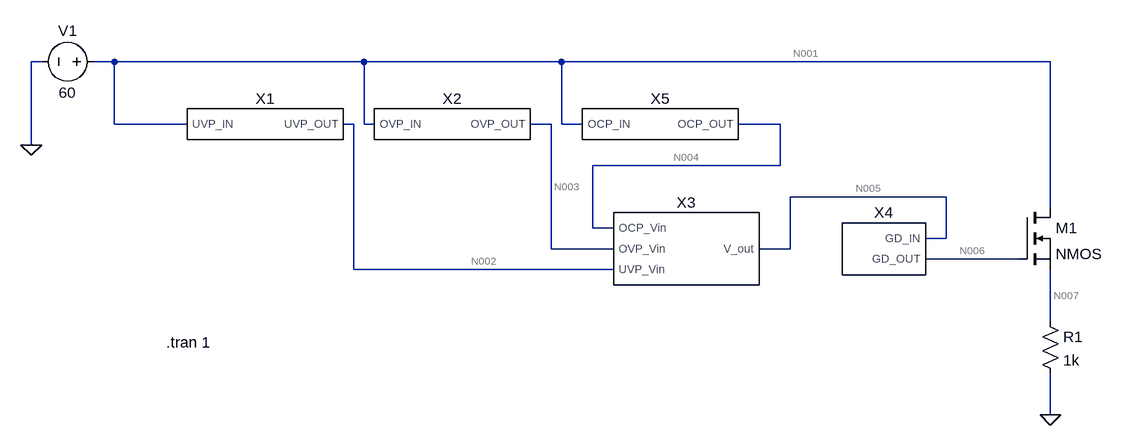
[diagram p0: schematic All.asc]
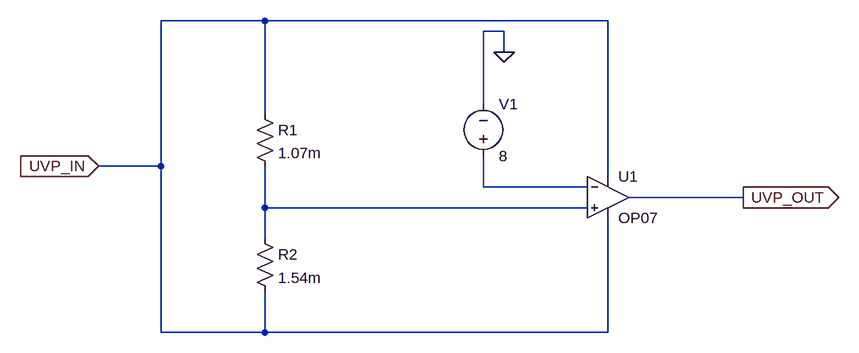
[diagram p1: sub-circuit uvp.asc]
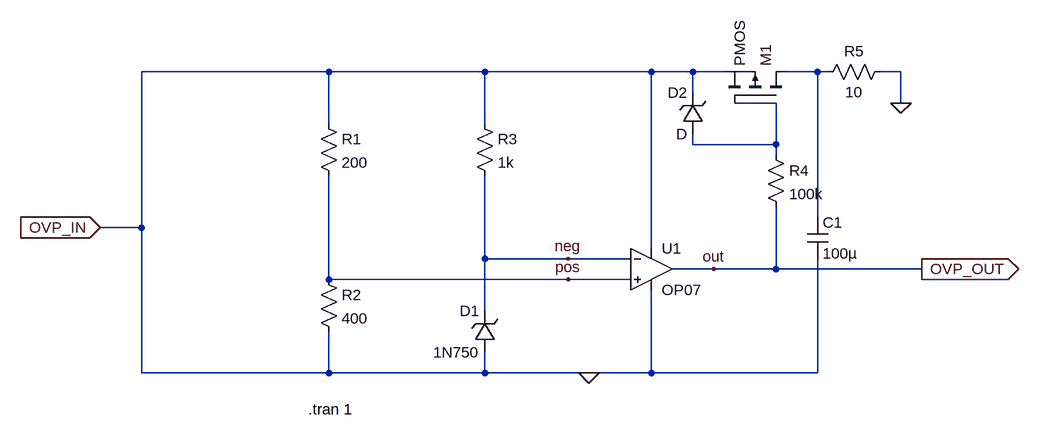
[diagram p2: sub-circuit ovp.asc]
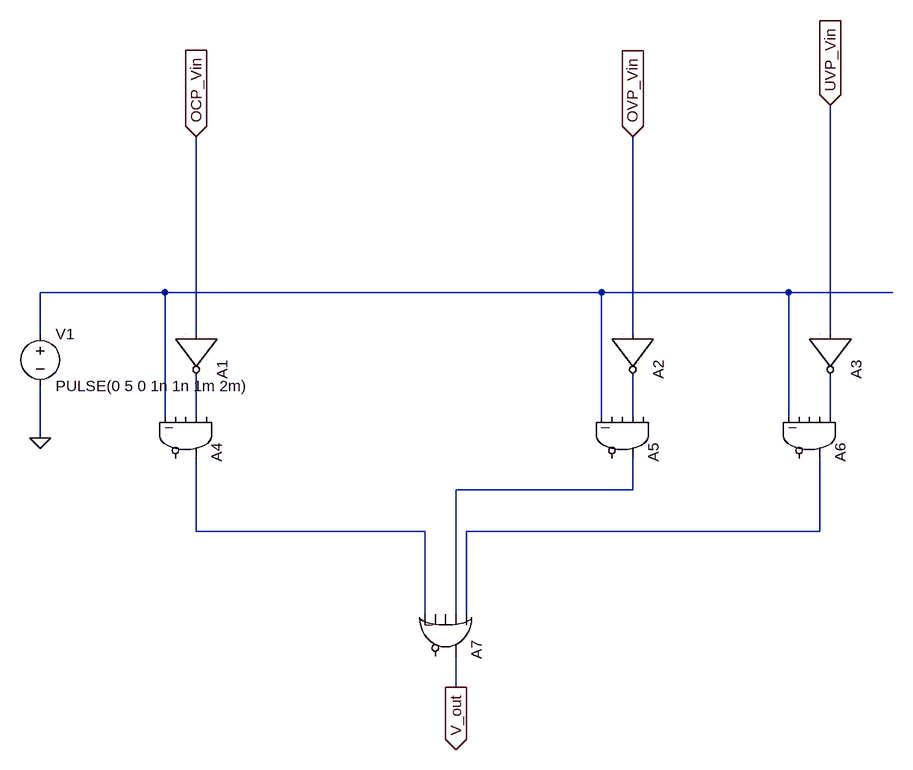
[diagram p3: sub-circuit control.asc]
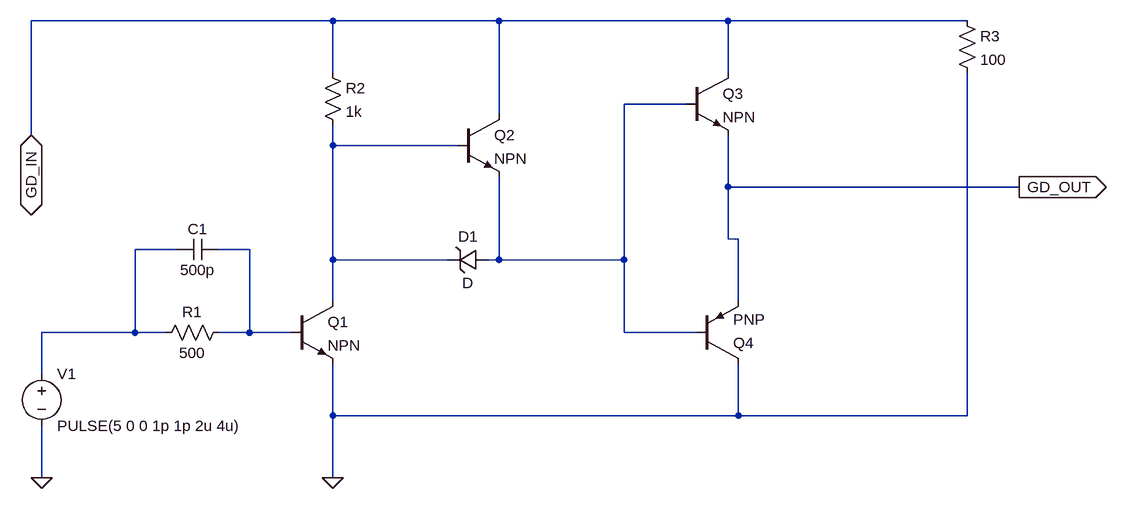
[diagram p4: sub-circuit gatedriver.asc]
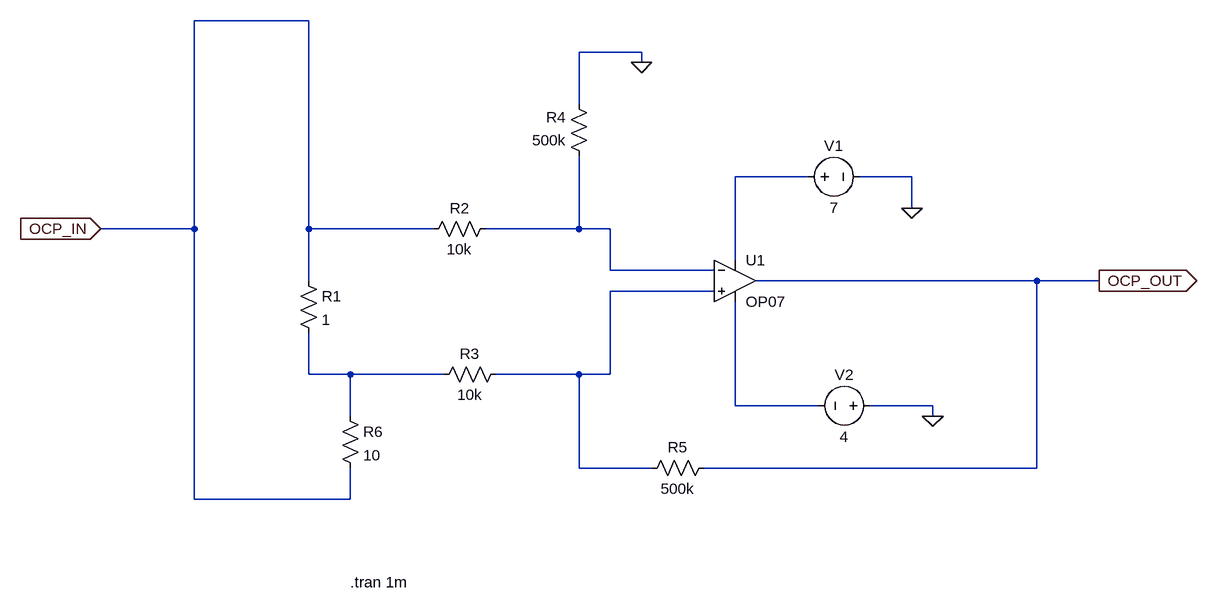
[diagram p5: sub-circuit ocp.asc]
All.asc, the LTspice schematic file:
Version 4
SHEET 1 1532 680
WIRE -96 80 -112 80
WIRE 16 80 -16 80
WIRE 400 80 16 80
WIRE 704 80 400 80
WIRE 1456 80 704 80
WIRE 16 176 16 80
WIRE 128 176 16 176
WIRE 384 176 368 176
WIRE 400 176 400 80
WIRE 416 176 400 176
WIRE 688 176 656 176
WIRE 704 176 704 80
WIRE 736 176 704 176
WIRE 1040 176 976 176
WIRE -112 208 -112 80
WIRE 1040 240 1040 176
WIRE 1040 240 752 240
WIRE 1296 288 1056 288
WIRE 1456 304 1456 80
WIRE 752 336 752 240
WIRE 784 336 752 336
WIRE 1296 352 1296 288
WIRE 1296 352 1264 352
WIRE 688 368 688 176
WIRE 784 368 688 368
WIRE 1056 368 1056 288
WIRE 1056 368 1008 368
WIRE 1408 384 1264 384
WIRE 384 400 384 176
WIRE 784 400 384 400
WIRE 1456 480 1456 400
WIRE 1456 624 1456 560
FLAG -112 208 0
FLAG 1456 624 0
SYMBOL voltage 0 80 R90
WINDOW 0 -32 56 VBottom 2
WINDOW 3 32 56 VTop 2
SYMATTR InstName V1
SYMATTR Value 60
SYMBOL UVP 240 176 R0
SYMATTR InstName X1
SYMBOL OVP 528 176 R0
SYMATTR InstName X2
SYMBOL Control 896 368 R0
SYMATTR InstName X3
SYMBOL GateDriver 1200 368 R0
SYMATTR InstName X4
SYMBOL nmos 1408 304 R0
SYMATTR InstName M1
SYMBOL res 1440 464 R0
SYMATTR InstName R1
SYMATTR Value 1k
SYMBOL OCP 848 176 R0
SYMATTR InstName X5
TEXT 96 512 Left 2 !.tran 1

uvp.asc, the sub-circuit schematic file:
Version 4
SHEET 1 1160 680
WIRE 272 64 112 64
WIRE 800 64 272 64
WIRE 640 80 608 80
WIRE 640 112 640 80
WIRE 608 192 608 80
WIRE 272 208 272 64
WIRE 112 288 112 64
WIRE 112 288 16 288
WIRE 800 304 800 64
WIRE 608 320 608 272
WIRE 768 320 608 320
WIRE 1008 336 832 336
WIRE 272 352 272 288
WIRE 768 352 272 352
WIRE 272 400 272 352
WIRE 112 544 112 288
WIRE 272 544 272 480
WIRE 272 544 112 544
WIRE 800 544 800 368
WIRE 800 544 272 544
FLAG 640 112 0
FLAG 16 288 UVP_IN
IOPIN 16 288 In
FLAG 1008 336 UVP_OUT
IOPIN 1008 336 Out
SYMBOL Res 256 192 R0
SYMATTR InstName R1
SYMATTR Value 1.07m
SYMBOL Res 256 384 R0
SYMATTR InstName R2
SYMATTR Value 1.54m
SYMBOL voltage 608 288 M180
WINDOW 0 24 96 Left 2
WINDOW 3 24 16 Left 2
SYMATTR InstName V1
SYMATTR Value 8
SYMBOL OpAmps/OP07 800 272 R0
SYMATTR InstName U1

ovp.asc, the sub-circuit schematic file:
Version 4
SHEET 1 1208 680
WIRE 144 96 -144 96
WIRE 384 96 144 96
WIRE 640 96 384 96
WIRE 704 96 640 96
WIRE 752 96 704 96
WIRE 896 96 848 96
WIRE 912 96 896 96
WIRE 1024 96 992 96
WIRE 704 128 704 96
WIRE 832 144 768 144
WIRE 1024 144 1024 96
WIRE 144 176 144 96
WIRE 384 176 384 96
WIRE 704 208 704 192
WIRE 832 208 832 144
WIRE 832 208 704 208
WIRE 832 224 832 208
WIRE 896 320 896 96
WIRE -144 336 -144 96
WIRE -144 336 -208 336
WIRE 640 368 640 96
WIRE 384 384 384 256
WIRE 512 384 384 384
WIRE 608 384 512 384
WIRE 736 400 672 400
WIRE 832 400 832 304
WIRE 832 400 736 400
WIRE 1056 400 832 400
WIRE 144 416 144 256
WIRE 512 416 144 416
WIRE 608 416 512 416
WIRE 384 464 384 384
WIRE -144 560 -144 336
WIRE 144 560 144 496
WIRE 144 560 -144 560
WIRE 384 560 384 528
WIRE 384 560 144 560
WIRE 544 560 384 560
WIRE 640 560 640 432
WIRE 640 560 544 560
WIRE 896 560 896 384
WIRE 896 560 640 560
FLAG 1024 144 0
FLAG 544 560 0
FLAG 512 384 neg
FLAG 512 416 pos
FLAG 736 400 out
FLAG -208 336 OVP_IN
IOPIN -208 336 In
FLAG 1056 400 OVP_OUT
IOPIN 1056 400 Out
SYMBOL Res 128 160 R0
SYMATTR InstName R1
SYMATTR Value 200
SYMBOL Res 128 400 R0
SYMATTR InstName R2
SYMATTR Value 400
SYMBOL Res 368 160 R0
SYMATTR InstName R3
SYMATTR Value 1k
SYMBOL OpAmps/OP07 640 336 R0
SYMATTR InstName U1
SYMBOL zener 400 528 R180
WINDOW 0 24 64 Left 2
WINDOW 3 24 0 Left 2
SYMATTR InstName D1
SYMATTR Value 1N750
SYMBOL Res 816 208 R0
SYMATTR InstName R4
SYMATTR Value 100k
SYMBOL pmos 848 144 M270
SYMATTR InstName M1
SYMBOL zener 720 192 R180
WINDOW 0 24 64 Left 2
WINDOW 3 24 0 Left 2
SYMATTR InstName D2
SYMBOL Res 1008 80 R90
WINDOW 0 0 56 VBottom 2
WINDOW 3 32 56 VTop 2
SYMATTR InstName R5
SYMATTR Value 10
SYMBOL cap 880 320 R0
SYMATTR InstName C1
SYMATTR Value 100µ
TEXT 112 616 Left 2 !.tran 1

control.asc, the sub-circuit schematic file:
Version 4
SHEET 1 1172 1120
WIRE 16 160 -176 160
WIRE 688 160 16 160
WIRE 976 160 688 160
WIRE 1136 160 976 160
WIRE -176 224 -176 160
WIRE 64 224 64 -80
WIRE 736 224 736 -80
WIRE 1040 224 1040 -128
WIRE 16 352 16 160
WIRE 64 352 64 288
WIRE 688 352 688 160
WIRE 736 352 736 288
WIRE 976 352 976 160
WIRE 1040 352 1040 288
WIRE -176 384 -176 304
WIRE 736 464 736 416
WIRE 736 464 464 464
WIRE 64 528 64 416
WIRE 416 528 64 528
WIRE 1024 528 1024 416
WIRE 1024 528 480 528
WIRE 416 656 416 528
WIRE 464 656 464 464
WIRE 480 656 480 528
WIRE 464 768 464 720
FLAG -176 384 0
FLAG 64 -80 OCP_Vin
IOPIN 64 -80 In
FLAG 736 -80 OVP_Vin
IOPIN 736 -80 In
FLAG 1040 -128 UVP_Vin
IOPIN 1040 -128 In
FLAG 464 768 V_out
IOPIN 464 768 Out
SYMBOL Digital/inv 128 224 R90
SYMATTR InstName A1
SYMBOL Digital/inv 800 224 R90
SYMATTR InstName A2
SYMBOL Digital/inv 1104 224 R90
SYMATTR InstName A3
SYMBOL voltage -176 208 R0
SYMATTR InstName V1
SYMATTR Value PULSE(0 5 0 1n 1n 1m 2m)
SYMBOL Digital/and 112 384 R90
SYMATTR InstName A4
SYMBOL Digital/and 784 384 R90
SYMATTR InstName A5
SYMBOL Digital/and 1072 384 R90
SYMATTR InstName A6
SYMBOL Digital/or 512 688 R90
SYMATTR InstName A7

gatedriver.asc, the sub-circuit schematic file:
Version 4
SHEET 1 1304 720
WIRE 112 0 -352 0
WIRE 368 0 112 0
WIRE 720 0 368 0
WIRE 1088 0 720 0
WIRE 112 80 112 0
WIRE 720 80 720 0
WIRE 656 128 560 128
WIRE 368 144 368 0
WIRE -352 176 -352 0
WIRE 112 192 112 160
WIRE 304 192 112 192
WIRE 720 256 720 176
WIRE 1168 256 720 256
WIRE 720 336 720 256
WIRE 736 336 720 336
WIRE -128 352 -192 352
WIRE -16 352 -64 352
WIRE 112 368 112 192
WIRE 288 368 112 368
WIRE 368 368 368 240
WIRE 368 368 352 368
WIRE 560 368 560 128
WIRE 560 368 368 368
WIRE 112 432 112 368
WIRE 736 432 736 336
WIRE -192 480 -192 352
WIRE -192 480 -336 480
WIRE -144 480 -192 480
WIRE -16 480 -16 352
WIRE -16 480 -64 480
WIRE 48 480 -16 480
WIRE 560 480 560 368
WIRE 672 480 560 480
WIRE -336 544 -336 480
WIRE 112 608 112 528
WIRE 736 608 736 528
WIRE 736 608 112 608
WIRE 1088 608 1088 80
WIRE 1088 608 736 608
WIRE -336 704 -336 624
WIRE 112 704 112 608
FLAG -336 704 0
FLAG 112 704 0
FLAG -352 176 GD_IN
IOPIN -352 176 BiDir
FLAG 1168 256 GD_OUT
IOPIN 1168 256 Out
SYMBOL voltage -336 528 R0
SYMATTR InstName V1
SYMATTR Value PULSE(5 0 0 1p 1p 2u 4u)
SYMBOL Res -48 464 R90
WINDOW 0 0 56 VBottom 2
WINDOW 3 32 56 VTop 2
SYMATTR InstName R1
SYMATTR Value 500
SYMBOL Cap -64 336 R90
WINDOW 0 0 32 VBottom 2
WINDOW 3 32 32 VTop 2
SYMATTR InstName C1
SYMATTR Value 500p
SYMBOL Res 96 64 R0
SYMATTR InstName R2
SYMATTR Value 1k
SYMBOL npn 48 432 R0
SYMATTR InstName Q1
SYMBOL zener 352 352 R90
WINDOW 0 -4 32 VBottom 2
WINDOW 3 36 32 VTop 2
SYMATTR InstName D1
SYMBOL npn 304 144 R0
SYMATTR InstName Q2
SYMBOL npn 656 80 R0
SYMATTR InstName Q3
SYMBOL pnp 672 528 M180
SYMATTR InstName Q4
SYMBOL Res 1072 -16 R0
SYMATTR InstName R3
SYMATTR Value 100

ocp.asc, the sub-circuit schematic file:
Version 4
SHEET 1 1288 752
WIRE -80 -128 -256 -128
WIRE 432 -80 336 -80
WIRE 432 -64 432 -80
WIRE 336 0 336 -80
WIRE 688 112 576 112
WIRE 848 112 768 112
WIRE 848 160 848 112
WIRE -256 192 -256 -128
WIRE -256 192 -400 192
WIRE -80 192 -80 -128
WIRE 112 192 -80 192
WIRE 336 192 336 80
WIRE 336 192 192 192
WIRE 384 192 336 192
WIRE 576 240 576 112
WIRE 384 256 384 192
WIRE 544 256 384 256
WIRE -80 272 -80 192
WIRE 1040 272 608 272
WIRE 1136 272 1040 272
WIRE 544 288 384 288
WIRE -80 416 -80 352
WIRE -16 416 -80 416
WIRE 128 416 -16 416
WIRE 336 416 208 416
WIRE 384 416 384 288
WIRE 384 416 336 416
WIRE 576 464 576 304
WIRE 704 464 576 464
WIRE 880 464 784 464
WIRE -16 480 -16 416
WIRE 880 480 880 464
WIRE 336 560 336 416
WIRE 448 560 336 560
WIRE 1040 560 1040 272
WIRE 1040 560 528 560
WIRE -256 608 -256 192
WIRE -16 608 -16 560
WIRE -16 608 -256 608
FLAG 432 -64 0
FLAG 848 160 0
FLAG 880 480 0
FLAG -400 192 OCP_IN
IOPIN -400 192 In
FLAG 1136 272 OCP_OUT
IOPIN 1136 272 Out
SYMBOL Res -96 256 R0
SYMATTR InstName R1
SYMATTR Value 1
SYMBOL Res 208 176 R90
WINDOW 0 0 56 VBottom 2
WINDOW 3 32 56 VTop 2
SYMATTR InstName R2
SYMATTR Value 10k
SYMBOL Res 224 400 R90
WINDOW 0 0 56 VBottom 2
WINDOW 3 32 56 VTop 2
SYMATTR InstName R3
SYMATTR Value 10k
SYMBOL Res 352 96 R180
WINDOW 0 36 76 Left 2
WINDOW 3 36 40 Left 2
SYMATTR InstName R4
SYMATTR Value 500k
SYMBOL Res 544 544 R90
WINDOW 0 0 56 VBottom 2
WINDOW 3 32 56 VTop 2
SYMATTR InstName R5
SYMATTR Value 500k
SYMBOL OpAmps/OP07 576 208 R0
SYMATTR InstName U1
SYMBOL Voltage 672 112 R270
WINDOW 0 32 56 VTop 2
WINDOW 3 -32 56 VBottom 2
SYMATTR InstName V1
SYMATTR Value 7
SYMBOL Res -32 464 R0
SYMATTR InstName R6
SYMATTR Value 10
SYMBOL voltage 800 464 R90
WINDOW 0 -32 56 VBottom 2
WINDOW 3 32 56 VTop 2
SYMATTR InstName V2
SYMATTR Value 4
TEXT -16 736 Left 2 !.tran 1m

The netlist it stands for:
* All.asc
V1 N001 0 60
XX1 N001 N002 uvp
XX2 N001 N003 ovp
XX3 N004 N003 N002 N005 control
XX4 N005 N006 gatedriver
M1 N001 N006 N007 N007 NMOS
R1 N007 0 1k
XX5 N001 N004 ocp

* block symbol definitions
.subckt uvp UVP_IN UVP_OUT
R1 UVP_IN N002 1.07m
R2 N002 UVP_IN 1.54m
V1 N001 0 8
XU1 N002 N001 UVP_IN UVP_IN UVP_OUT LT1001  ; OP07, pins In+ In- V+ V- OUT
.ends uvp

.subckt ovp OVP_IN OVP_OUT
R1 0 pos 200
R2 pos 0 400
R3 0 neg 1k
XU1 pos neg 0 0 OVP_OUT LT1001  ; OP07, pins In+ In- V+ V- OUT
D1 0 neg 1N750
R4 N002 OVP_OUT 100k
M1 N001 N002 0 0 PMOS
D2 N002 0 D
R5 0 N001 10
C1 N001 0 100µ
.tran 1
.ends ovp

.subckt control OCP_Vin OVP_Vin UVP_Vin V_out
A1 OCP_Vin 0 0 0 0 N002 0 0 BUF
A2 OVP_Vin 0 0 0 0 N003 0 0 BUF
A3 UVP_Vin 0 0 0 0 N004 0 0 BUF
V1 N001 0 PULSE(0 5 0 1n 1n 1m 2m)
A4 0 N002 0 0 N001 0 N006 0 AND
A5 0 N003 0 0 N001 0 N005 0 AND
A6 N004 0 0 0 N001 0 N007 0 AND
A7 N007 N005 0 0 N006 0 V_out 0 OR
.ends control

.subckt gatedriver GD_IN GD_OUT
V1 N003 0 PULSE(5 0 0 1p 1p 2u 4u)
R1 N004 N003 500
C1 N004 N003 500p
R2 GD_IN N002 1k
Q1 N002 N004 0 0 NPN
D1 N001 N002 D
Q2 GD_IN N002 N001 0 NPN
Q3 GD_IN N001 GD_OUT 0 NPN
Q4 0 N001 GD_OUT 0 PNP
R3 GD_IN 0 100
.ends gatedriver

.subckt ocp OCP_IN OCP_OUT
R1 OCP_IN N004 1
R2 N002 OCP_IN 10k
R3 N003 N004 10k
R4 N002 0 500k
R5 OCP_OUT N003 500k
XU1 N003 N002 N001 N005 OCP_OUT LT1001  ; OP07, pins In+ In- V+ V- OUT
V1 N001 0 7
R6 N004 OCP_IN 10
V2 0 N005 4
.tran 1m
.ends ocp

.model D D
.lib standard.dio
.model NPN NPN
.model PNP PNP
.lib standard.bjt
.model NMOS NMOS
.model PMOS PMOS
.lib standard.mos
.tran 1
.lib LTC.lib
.backanno
.end

* Results of the author's LTspice run, read from the files saved beside the schematic
* Operating Point, zero values left out:
*   V(n001) = 60 V
*   V(n002) = 60 V
*   V(n003) = 60 V
*   V(n004) = -3.058 V
*   V(n005) = 17.71 µV
*   V(n006) = 9.551 mV
*   V(n007) = 1.032 µV
*   Id(M1) = 1.032 nA
*   Ib(M1) = -60.01 pA
*   Is(M1) = -971.9 pA
*   I(R1) = 1.032 nA
*   I(V1) = -44.15 mA
*   Ix(x1:UVP_IN) = 43.91 mA
*   Ix(x2:OVP_IN) = -149.6 nA
*   Ix(x3:V_OUT) = 17.71 µA
*   Ix(x4:GD_IN) = -17.71 µA
*   Ix(x5:OCP_IN) = 241.3 µA
*   Ix(x5:OCP_OUT) = 9.117 pA